# Altium schematic sheet InverterConnectors.SchDoc: Inverter Connectors
size Letter; Engineer: Nathan Petersen; DocumentNumber: 17; Revision: v1.2; SheetNumber: 17; SheetTotal: 26
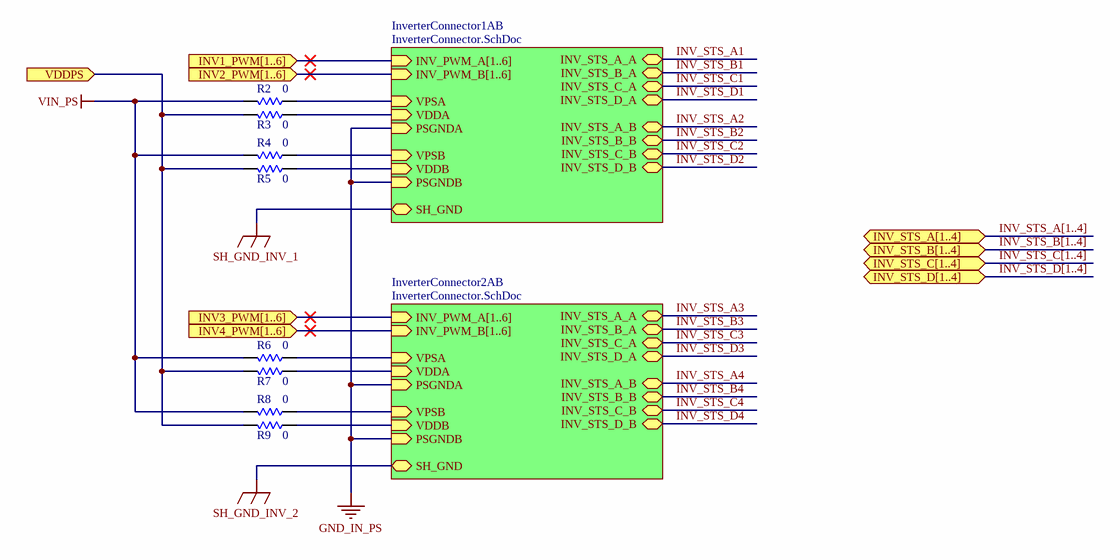
[diagram p0: InverterConnectors.SchDoc]

## Parts
R2  value 0  [1206-RES]  (hidden comment: Resistor)
R3  value 0  [1206-RES]  (hidden comment: Resistor)
R4  value 0  [1206-RES]  (hidden comment: Resistor)
R5  value 0  [1206-RES]  (hidden comment: Resistor)
R6  value 0  [1206-RES]  (hidden comment: Resistor)
R7  value 0  [1206-RES]  (hidden comment: Resistor)
R8  value 0  [1206-RES]  (hidden comment: Resistor)
R9  value 0  [1206-RES]  (hidden comment: Resistor)

## Sub-sheets
InverterConnector1AB = InverterConnector.SchDoc: INV_PWM_A[1..6] (in), INV_PWM_B[1..6] (in), SH_GND (bidir), INV_STS_A_B (bidir), INV_STS_A_A (bidir), INV_STS_B_A (bidir), INV_STS_C_A (bidir), INV_STS_D_A (bidir), INV_STS_B_B (bidir), INV_STS_C_B (bidir), INV_STS_D_B (bidir), VPSA (in), VDDA (in), PSGNDA (in), VPSB (in), VDDB (in), PSGNDB (in)
InverterConnector2AB = InverterConnector.SchDoc: INV_PWM_A[1..6] (in), INV_PWM_B[1..6] (in), SH_GND (bidir), INV_STS_A_B (bidir), INV_STS_A_A (bidir), INV_STS_B_A (bidir), INV_STS_C_A (bidir), INV_STS_D_A (bidir), INV_STS_B_B (bidir), INV_STS_C_B (bidir), INV_STS_D_B (bidir), VPSA (in), VDDA (in), PSGNDA (in), VPSB (in), VDDB (in), PSGNDB (in)

## Ports
INV1_PWM[1..6] (in), INV2_PWM[1..6] (in), INV3_PWM[1..6] (in), INV4_PWM[1..6] (in), INV_STS_A[1..4] (bidir), INV_STS_B[1..4] (bidir), INV_STS_C[1..4] (bidir), INV_STS_D[1..4] (bidir), VDDPS (in)

## Nets
GND_IN_PS: sheet InverterConnector1AB/PSGNDA, sheet InverterConnector1AB/PSGNDB, sheet InverterConnector2AB/PSGNDA, sheet InverterConnector2AB/PSGNDB
SH_GND_INV_1: sheet InverterConnector1AB/SH_GND
SH_GND_INV_2: sheet InverterConnector2AB/SH_GND
VIN_PS: R2.2 R4.2 R6.2 R8.2
INV_STS_A1: sheet InverterConnector1AB/INV_STS_A_A
INV_STS_A2: sheet InverterConnector1AB/INV_STS_A_B
INV_STS_A3: sheet InverterConnector2AB/INV_STS_A_A
INV_STS_A4: sheet InverterConnector2AB/INV_STS_A_B
INV_STS_B1: sheet InverterConnector1AB/INV_STS_B_A
INV_STS_B2: sheet InverterConnector1AB/INV_STS_B_B
INV_STS_B3: sheet InverterConnector2AB/INV_STS_B_A
INV_STS_B4: sheet InverterConnector2AB/INV_STS_B_B
INV_STS_C1: sheet InverterConnector1AB/INV_STS_C_A
INV_STS_C2: sheet InverterConnector1AB/INV_STS_C_B
INV_STS_C3: sheet InverterConnector2AB/INV_STS_C_A
INV_STS_C4: sheet InverterConnector2AB/INV_STS_C_B
INV_STS_D1: sheet InverterConnector1AB/INV_STS_D_A
INV_STS_D2: sheet InverterConnector1AB/INV_STS_D_B
INV_STS_D3: sheet InverterConnector2AB/INV_STS_D_A
INV_STS_D4: sheet InverterConnector2AB/INV_STS_D_B
VDDPS: R3.2 R5.2 R7.2 R9.2 ; port VDDPS
NetR2_1: R2.1 ; sheet InverterConnector1AB/VPSA
NetR3_1: R3.1 ; sheet InverterConnector1AB/VDDA
NetR4_1: R4.1 ; sheet InverterConnector1AB/VPSB
NetR5_1: R5.1 ; sheet InverterConnector1AB/VDDB
NetR6_1: R6.1 ; sheet InverterConnector2AB/VPSA
NetR7_1: R7.1 ; sheet InverterConnector2AB/VDDA
NetR8_1: R8.1 ; sheet InverterConnector2AB/VPSB
NetR9_1: R9.1 ; sheet InverterConnector2AB/VDDB

## Buses and harness runs
bus INV_STS_A[1..4] = port INV_STS_A[1..4]
bus INV_STS_B[1..4] = port INV_STS_B[1..4]
bus INV_STS_C[1..4] = port INV_STS_C[1..4]
bus INV_STS_D[1..4] = port INV_STS_D[1..4]
bus port INV1_PWM[1..6] = sheet InverterConnector1AB/INV_PWM_A[1..6]
bus port INV2_PWM[1..6] = sheet InverterConnector1AB/INV_PWM_B[1..6]
bus port INV3_PWM[1..6] = sheet InverterConnector2AB/INV_PWM_A[1..6]
bus port INV4_PWM[1..6] = sheet InverterConnector2AB/INV_PWM_B[1..6]

## Notes on the sheet
- Title:
- File:
- Sheet:
- of
- Revision:
- Time:
- Date:
- Engineer:

## Library data of the parts
R2-R9 = Resistor: Supplier 1: Digi-Key; Supplier Part Number 1: 311-0.0ERCT-ND